# EAGLE design espAdapter (EAGLE 6.1)
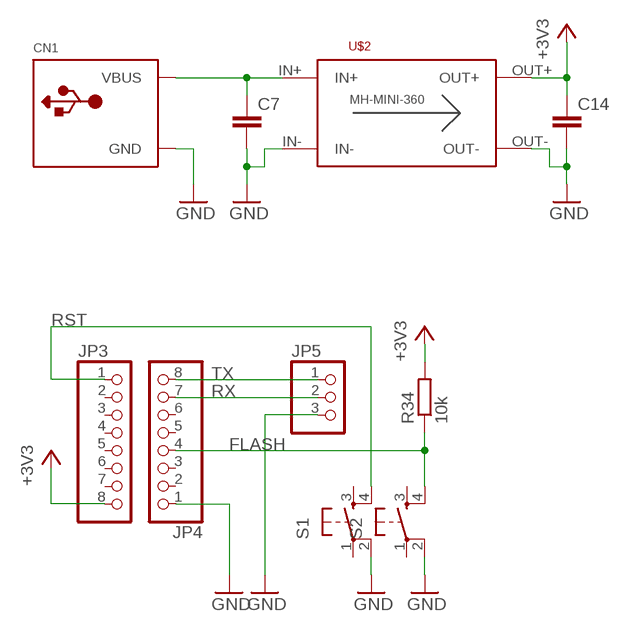
[diagram p0: schematic, sheet 1]

## Parts
C7  C-EU025-025X050  [C025-025X050]
C14  C-EU025-025X050  [C025-025X050]
CN1  USBPWR-ONLY  [USB-MINIB-THM]
JP3  PINHD-1X8  [1X08]
JP4  PINHD-1X8  [1X08]
JP5  PINHD-1X3  [1X03]
R34  10k  R-EU_0204/7  [0204/7]
S1  TAC_SWITCHPTH  [TACTILE-PTH]
S2  TAC_SWITCHPTH  [TACTILE-PTH]
U$2  DC-DC_CONV_MINISTD  [DC-DC_CONV_MINI]

## Nets
+3V3: C14.1 JP3.8 R34.2 U$2.OUT+
FLASH: JP4.4 R34.1 S2.4
GND: C7.2 C14.2 CN1.GND CN1.GND1(GND) CN1.GND2(GND) CN1.GND3(GND) CN1.GND4(GND) JP4.1 JP5.3 S1.2 S2.2 U$2.IN- U$2.OUT-
N$72: C7.1 CN1.VBUS U$2.IN+
RST: JP3.1 S1.4
RX: JP4.7 JP5.2
TX: JP4.8 JP5.1
Unconnected: JP3.2 JP3.3 JP3.4 JP3.5 JP3.6 JP3.7 JP4.2 JP4.3 JP4.5 JP4.6 S1.1 S1.3 S2.1 S2.3

## Library data of the parts
C7 C14 = rcl:C-EU: CAPACITOR, European symbol
CN1 = _MY_OWN_LIB:USB: USB Connectors USBMINIB - Surface Mount Female Mini-B USB Connector 4UConnector: 06564 By microbuilder.eu Thru-hole RA Female Mini-B USB Connector 4UConnector: 18732 By ladyada.net
JP3 JP4 = pinhead:PINHD-1X8: PIN HEADER
JP5 = pinhead:PINHD-1X3: PIN HEADER
R34 = rcl:R-EU_: RESISTOR, European symbol
S1 S2 = SparkFun-Electromechanical:TAC_SWITCH: Momentary Switch Button commonly used for reset or general input. Spark Fun Electronics SKU : COM-00097 SMT- SWCH-08247
U$2 = _MY_OWN_LIB:DC-DC_CONV_MINI

## Board
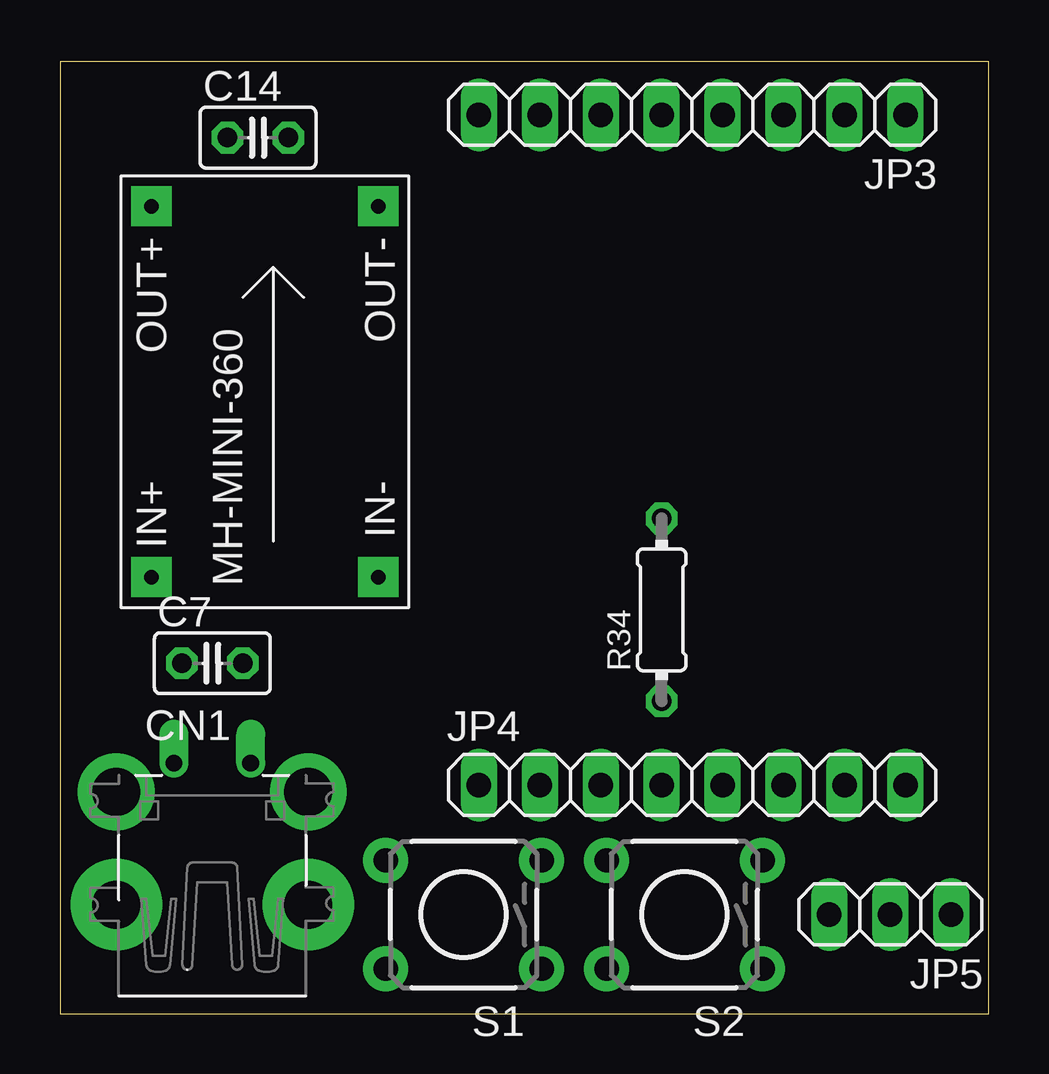
[diagram p1: board, top side]
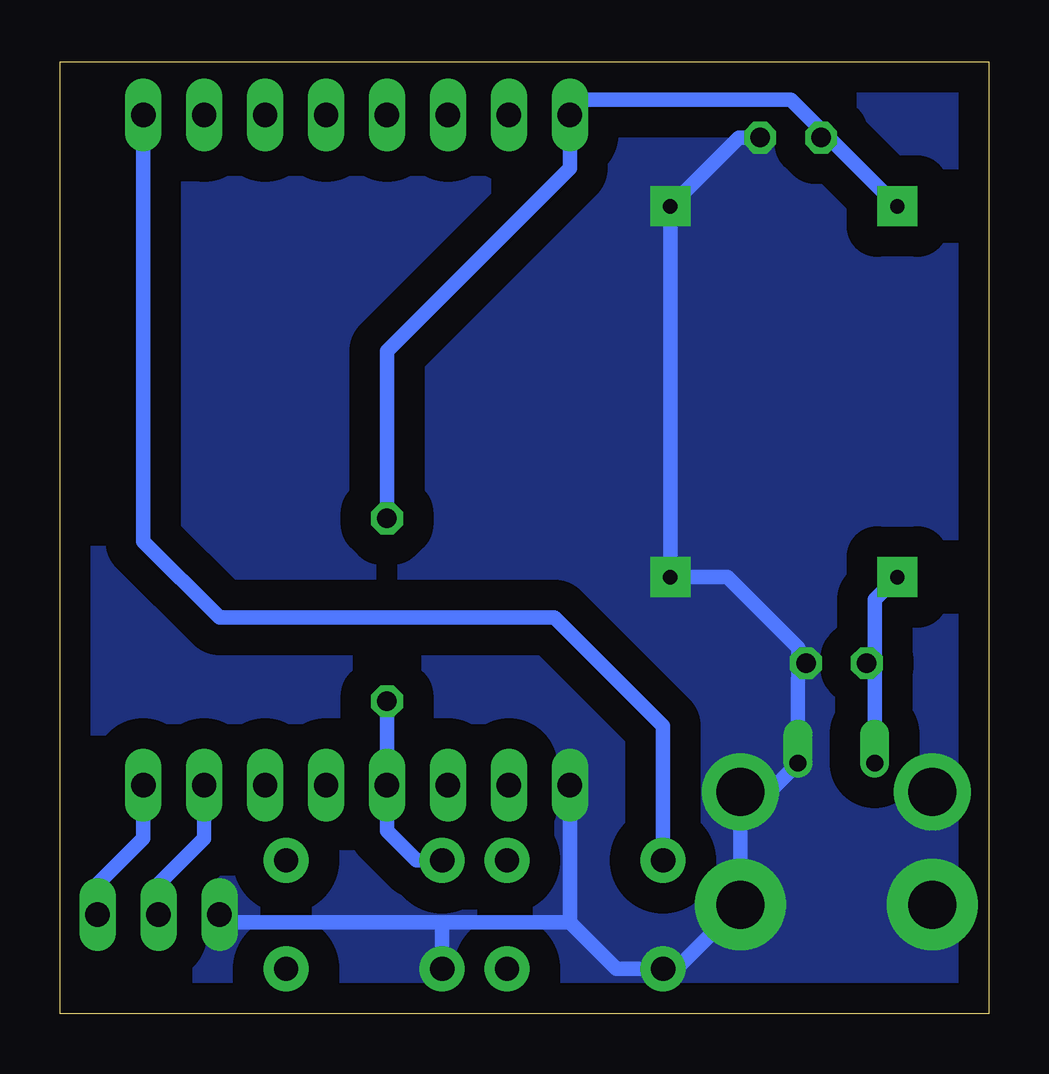
[diagram p2: board, bottom side, seen from below]

Size 38.72 x 39.67 mm. Coordinates in mm from the lower left corner, seen from the top.
Outline: 0,0 38.72,0 38.72,39.67 0,39.67 0,0
Copper layers (1*16): Top 0.035mm / dielectric 1.5mm / Bottom 0.035mm
Design rules: minimum track width 10mil, minimum drill 24mil, track to track 12mil, track to pad 12mil, pad to pad 12mil, via to via 12mil, smd to smd 10mil, copper to edge 12mil, drill to drill 12mil, minimum pad ring 10mil, minimum via ring 10mil, stop-mask expansion 4mil, vias tented up to drill 0mil, thermal gap 12mil

### Footprints (pad centres in the part's own frame; a part is rotated, then mirrored left to right if it is on the bottom)
C025-025X050 = drill 0.813 octagon: 1 -1.27,0; 2 1.27,0
USB-MINIB-THM = drill 0.7 offset: GND 1.6,9.8; VBUS -1.6,9.8 | drill 2 pad 3.81: GND1 -4,3.9; GND4 4,3.9 | drill 2 pad 3.2: GND2 -4,8.6; GND3 4,8.6
1X08 = drill 1.016 long: 1 -8.89,0; 2 -6.35,0; 3 -3.81,0; 4 -1.27,0; 5 1.27,0; 6 3.81,0; 7 6.35,0; 8 8.89,0
1X03 = drill 1.016 long: 1 -2.54,0; 2 0,0; 3 2.54,0
0204/7 = drill 0.813 octagon: 1 -3.81,0; 2 3.81,0
TACTILE-PTH = drill 1.016 pad 1.88: 1 -3.251,2.261; 2 3.251,2.261; 3 -3.251,-2.261; 4 3.251,-2.261
DC-DC_CONV_MINI = drill 0.6 pad 1.676 square: IN+ 16.73,1.27; IN- 16.73,10.73; OUT+ 1.27,1.27; OUT- 1.27,10.73

### Placement (x,y rotation side)
C7  6.35,14.61 0 top
C14  8.26,36.51 0 top
CN1  6.35,0.64 0 top
JP3  26.35,37.47 180 top
JP4  26.35,9.53 0 top
JP5  34.61,4.13 180 top
R34  25.08,16.83 90 top
S1  16.83,4.13 180 top
S2  26.04,4.13 180 top
U$2  2.54,34.92 270 top

### Tracks (layer width: path | path; a pad name or v marks a point on that pad's centre or on a via)
+3V3
  Bottom 0.61: U$2.OUT+ 6.83,36.67 | 6.83,36.67 8.26,38.1 16.83,38.1 JP3.8 17.46,35.24 25.08,27.62 R34.2 | C14.1 6.83,36.67
FLASH
  Bottom 0.61: S2.4 23.85,6.39 25.08,7.62 JP4.4 R34.1
GND
  Bottom 0.61: 7.94,14.61 7.94,15.24 10.89,18.2 U$2.IN- U$2.OUT- 10.41,36.51 C14.2 | 7.94,14.61 7.94,13.97 7.95,13.96 CN1.GND 9.15,9.23 CN1.GND3 CN1.GND4 13.02,1.87 S1.2 15.52,1.87 17.46,3.81 | C7.2 7.94,14.61 | 17.46,3.81 22.86,3.81 | 22.86,3.81 31.75,3.81 JP5.3 | S2.2 22.78,3.73 22.86,3.81 | JP4.1 17.46,3.81
  pour Bottom (isolate 1.27, no thermals): 0,39.69 38.73,39.69 38.73,0 0,0
N$72
  Bottom 0.61: CN1.VBUS 4.75,14.61 | 4.75,14.61 4.75,17.25 U$2.IN+ | C7.1 4.75,14.61
RST
  Bottom 0.61: S1.4 13.58,11.99 18.1,16.51 32.07,16.51 35.24,19.68 JP3.1
RX
  Bottom 0.61: JP5.2 34.61,5.4 32.7,7.3 JP4.7
TX
  Bottom 0.61: JP5.1 37.15,5.4 35.24,7.3 JP4.8